# Altium schematic sheet Motors.SchDoc
size B
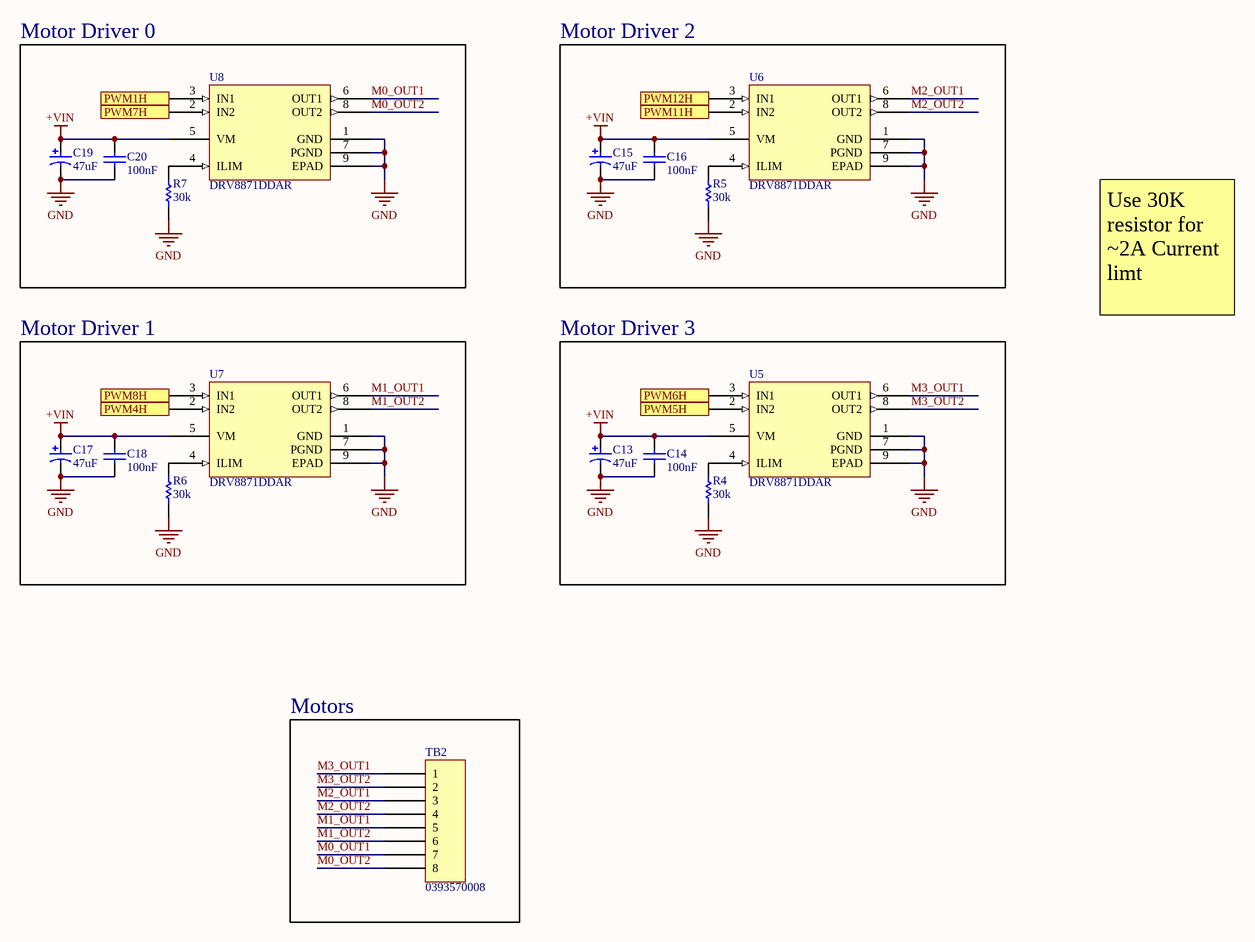
[diagram p0: Motors.SchDoc]

## Parts
C13  47uF  [EEE-FT1C470AR]
C14  100nF  [0402]
C15  47uF  [EEE-FT1C470AR]
C16  100nF  [0402]
C17  47uF  [EEE-FT1C470AR]
C18  100nF  [0402]
C19  47uF  [EEE-FT1C470AR]
C20  100nF  [0402]
R4  30k  [0402]
R5  30k  [0402]
R6  30k  [0402]
R7  30k  [0402]
TB2  0393570008  [0393570008]
U5  DRV8871DDAR  [8-HSOP]
U6  DRV8871DDAR  [8-HSOP]
U7  DRV8871DDAR  [8-HSOP]
U8  DRV8871DDAR  [8-HSOP]

## Blocks framed on the sheet
Motor Driver 0: C19 C20 R7 U8
Motor Driver 2: C15 C16 R5 U6
Motor Driver 1: C17 C18 R6 U7
Motor Driver 3: C13 C14 R4 U5
Motors: TB2

## Ports
PWM1H (in), PWM4H (in), PWM5H (in), PWM6H (in), PWM7H (in), PWM8H (in), PWM11H (in), PWM12H (in)

## Nets
+VIN: C13.1 C14.2 C15.1 C16.2 C17.1 C18.2 C19.1 C20.2 U5.5(VM) U6.5(VM) U7.5(VM) U8.5(VM)
GND: C13.2 C14.1 C15.2 C16.1 C17.2 C18.1 C19.2 C20.1 R4.1 R5.1 R6.1 R7.1 U5.1(GND) U5.7(PGND) U5.9(EPAD) U6.1(GND) U6.7(PGND) U6.9(EPAD) U7.1(GND) U7.7(PGND) U7.9(EPAD) U8.1(GND) U8.7(PGND) U8.9(EPAD)
M0_OUT1: TB2.7 U8.6(OUT1)
M0_OUT2: TB2.8 U8.8(OUT2)
M1_OUT1: TB2.5 U7.6(OUT1)
M1_OUT2: TB2.6 U7.8(OUT2)
M2_OUT1: TB2.3 U6.6(OUT1)
M2_OUT2: TB2.4 U6.8(OUT2)
M3_OUT1: TB2.1 U5.6(OUT1)
M3_OUT2: TB2.2 U5.8(OUT2)
PWM1H: U8.3(IN1) ; port PWM1H
PWM4H: U7.2(IN2) ; port PWM4H
PWM5H: U5.2(IN2) ; port PWM5H
PWM6H: U5.3(IN1) ; port PWM6H
PWM7H: U8.2(IN2) ; port PWM7H
PWM8H: U7.3(IN1) ; port PWM8H
PWM11H: U6.2(IN2) ; port PWM11H
PWM12H: U6.3(IN1) ; port PWM12H
NetR4_2: R4.2 U5.4(ILIM)
NetR5_2: R5.2 U6.4(ILIM)
NetR6_2: R6.2 U7.4(ILIM)
NetR7_2: R7.2 U8.4(ILIM)

## Notes on the sheet
- Use 30K resistor for ~2A Current limt
- Title
- Size:
- Date:
- B
- Number:
- Time:
- Revision:
- Sheet
- of
- File:

## Library data of the parts
C13 C15 C17 C19 = EEE-FT1C470AR: PANASONIC - EEEFT1C470AR - SMD Aluminium Electrolytic Capacitor, Radial Can - SMD, 47 µF, 16 V, 0.85 ohm, FT Series; Polarity: Polar; Voltage: 16V; Leakage Current: 7.5uA; Life (Hours): 2000Hour; Tolerance: 20%; Ripple Current: 160mA; ESR (Equivalent Series Resistance): 850mR; Lead Diameter: 0.65mm; Part Name: EEE-FT1C470AR; Supplier 1: Digi-Key; Supplier Part Number 1: P15090CT-ND; Manufacturer: Panasonic; Manufacturer Part Number: EEEFT1C470AR; RoHS: Yes; Category: Aluminum Electrolytic Capacitors; Stock 1: 48806; Pricing 1: 1=0.42000, 10=0.29800, 100=0.19590, 500=0.14514, 1000=0.12337 (USD); Mount: Surface Mount; Case/Package: Radial; Contact Plating: Tin; Min Operating Temperature: -55°C; Max Operating Temperature: 105°C; Termination: SMD/SMT; Capacitance: 47uF; Packaging: Tape and Reel; Voltage Rating: 16V; Ripple Current (AC): 160mA; Package Quantity: 2000; Voltage Rating (DC): 16V; Diameter: 4mm; Length: 5.8mm; Height: 5.8mm; Lead Pitch: 1mm; Height - Seated (Max): 0.24inch; Radiation Hardening: No; REACH SVHC: No SVHC
C14 C16 C18 C20 = C1005X7R1C104K050BC: TDK - C1005X7R1C104K050BC. - CERAMIC CAPACITOR, 0.1UF, 16V, X7R, 10%, 0402, FULL REEL; Part Name: C1005X7R1C104K050BC; Supplier 1: Digi-Key; Supplier Part Number 1: 445-4952-1-ND; Manufacturer: TDK; Manufacturer Part Number: C1005X7R1C104K050BC; RoHS: Yes; Category: Ceramic Capacitors; Stock 1: 2957810; Pricing 1: 1=0.10000, 10=0.07500, 100=0.03350, 500=0.02390, 1000=0.01879, 2500=0.01708, 5000=0.01571 (USD); Mount: Surface Mount; Case/Package: 0402; Min Operating Temperature: -55°C; Max Operating Temperature: 125°C; Termination: SMD/SMT; Voltage: 16V; Tolerance: 10%; Capacitance: 100nF; Packaging: Tape and Reel; Voltage Rating: 16V; Package Quantity: 1; Voltage Rating (DC): 16V; Length: 1mm; Height: 0.5mm; Radiation Hardening: No; REACH SVHC: Unknown; Number of Pins: 2; Weight: 2.3E-05oz; Case Code (Metric): 1005; Case Code (Imperial): 0402; Dielectric Material: Ceramic; Dielectric: X7R; Composition: Ceramic; Depth: 0.5mm; Thickness: 0.022inch; Width: 0.02inch; Lead Free: Lead Free
R4-R7 = CRCW040230K0FKED: Res Thick Film 0402 30K Ohm 1% 0.063W(1/16W) ±100ppm/C Molded SMD Automotive Paper T/R; Manufacturer: Vishay; Power Rating: 63mW; Temperature Coefficient: 100ppm/°C; Voltage Rating: 50V; Part Name: CRCW040230K0FKED; Supplier 1: Digi-Key; Supplier Part Number 1: 541-30.0KLCT-ND; Manufacturer Part Number: CRCW040230K0FKED; RoHS: Yes; Category: Chip SMD Resistors; Stock 1: 3845; Pricing 1: 1=0.10000, 10=0.03600, 100=0.01460, 1000=0.00657, 2500=0.00570, 5000=0.00471 (USD); Case/Package: 0402; Weight: 2.3E-05oz; Case Code (Metric): 1005; Case Code (Imperial): 0402; Contact Plating: Tin; Min Operating Temperature: -55°C; Max Operating Temperature: 155°C; Packaging: Tape and Reel; Tolerance: 1%; Termination: SMD/SMT; Package Quantity: 10000; Resistance: 30k; Military Standard: Not; Composition: Thick Film; Max Power Dissipation: 63mW; Number of Terminations: 2; Voltage Rating (DC): 50V; Length: 1mm; Height: 0.35mm; Width: 0.5mm; Depth: 0.5mm; Radiation Hardening: No; Lead Free: Lead Free
TB2 = 0393570008: Conn Eurostyle Block 8 POS 3.5mm Solder ST Thru-Hole 17.5A/Contact; Manufacturer: Molex; Number of Contacts: 8; Max Voltage Rating (AC): 300V; Wire Gauge (Max): 28AWG; Wire Gauge (Min): 16AWG; Plating: Nickel; Number of Levels: 1; Current: 12A; Part Name: 0393570008; Supplier 1: Digi-Key; Supplier Part Number 1: 23-0393570008-ND; Manufacturer Part Number: 0393570008; RoHS: Yes; Category: Terminal Blocks; Stock 1: 351; Pricing 1: 1=3.02000, 10=2.29800, 25=2.15280, 50=1.91360, 100=1.87200, 250=1.72640, 500=1.56000, 1000=1.38320, 5000=1.30000 (USD); Mount: Through Hole; Contact Plating: Tin; Contact Material: Copper; Housing Color: Black; Housing Material: Polyamide; Min Operating Temperature: -30°C; Max Operating Temperature: 85°C; Packaging: Bulk; Number of Rows: 1; Termination: Solder; Orientation: Straight; Max Supply Voltage (AC): 300V; Length: 28mm; Pitch: 3.5mm; Depth: 7.29mm; ComponentLink1URL: http://components.arrow.com/part/dataview/0323_07191186?src-supplier=Arrow+Europe; ComponentLink1Description: http://components.arrow.com/part/dataview/0323_07191186?src-supplier=Arrow+Europe; ComponentLink2URL: http://components.arrow.com/part/dataview/42878979S8737925N3303?src-supplier=Arrow; ComponentLink2Description: http://components.arrow.com/part/dataview/42878979S8737925N3303?src-supplier=Arrow; Color: Black; Number of Positions Per Level: 8; Voltage: 300V; Radiation Hardening: No
U5-U8 = DRV8871DDAR: IC BRUSHED DC MOTOR 8SOIC; Manufacturer: Texas Instruments; Interface: PWM; Max Output Current: 3.6A; Fault Protection: Over Temperature; Part Name: DRV8871DDAR; Supplier 1: Digi-Key; Supplier Part Number 1: 296-43024-1-ND; Manufacturer Part Number: DRV8871DDAR; RoHS: Yes; Category: Embedded Processors and Controllers; Stock 1: 10035; Pricing 1: 1=1.87000, 10=1.67900, 25=1.58360, 100=1.26690, 250=1.10852, 500=1.07686, 1000=0.85516 (USD); Min Operating Temperature: -40°C; Max Operating Temperature: 125°C; Packaging: Tape and Reel; ComponentLink1URL: http://www.ti.com/lit/pdf/slyb165?src-supplier=Digi-Key; ComponentLink1Description: http://www.ti.com/lit/pdf/slyb165?src-supplier=Digi-Key; ComponentLink2URL: http://www.ti.com/lit/ds/symlink/drv8871.pdf?src-supplier=Digi-Key; ComponentLink2Description: http://www.ti.com/lit/ds/symlink/drv8871.pdf?src-supplier=Digi-Key; Mount: Surface Mount; Lead Free: Lead Free